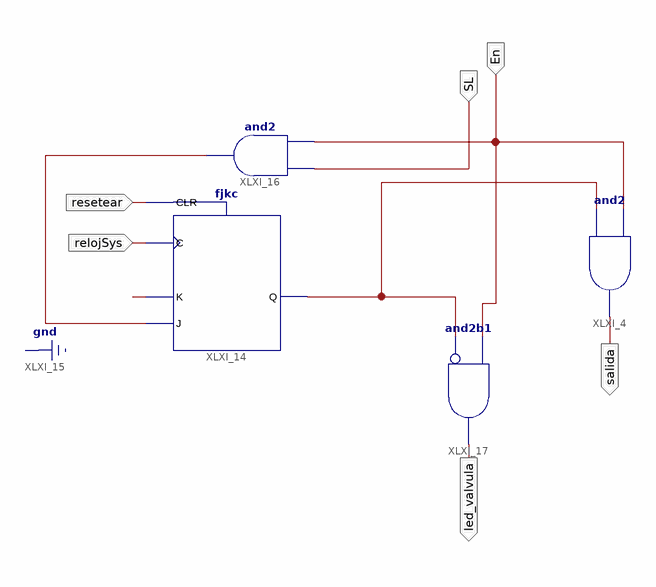
[diagram p0: schematic sheet 1]
// Xilinx ISE schematic valvula.sch (spartan3e) as structural Verilog: 4 symbols, 6 ports
module valvula (
  input  En,
  input  SL,
  input  relojSys,
  input  resetear,
  output salida,
  output led_valvula
);

  wire FF, XLXN_23;

  fjkc XLXI_14 (.C(relojSys), .CLR(resetear), .J(XLXN_23), .K(1'b0), .Q(FF));
  and XLXI_16 (XLXN_23, En, SL);
  and XLXI_17 (led_valvula, ~FF, En);  // and2b1
  and XLXI_4 (salida, FF, En);
endmodule
